# EAGLE design EASCapeRev1A (EAGLE 8.5.2)
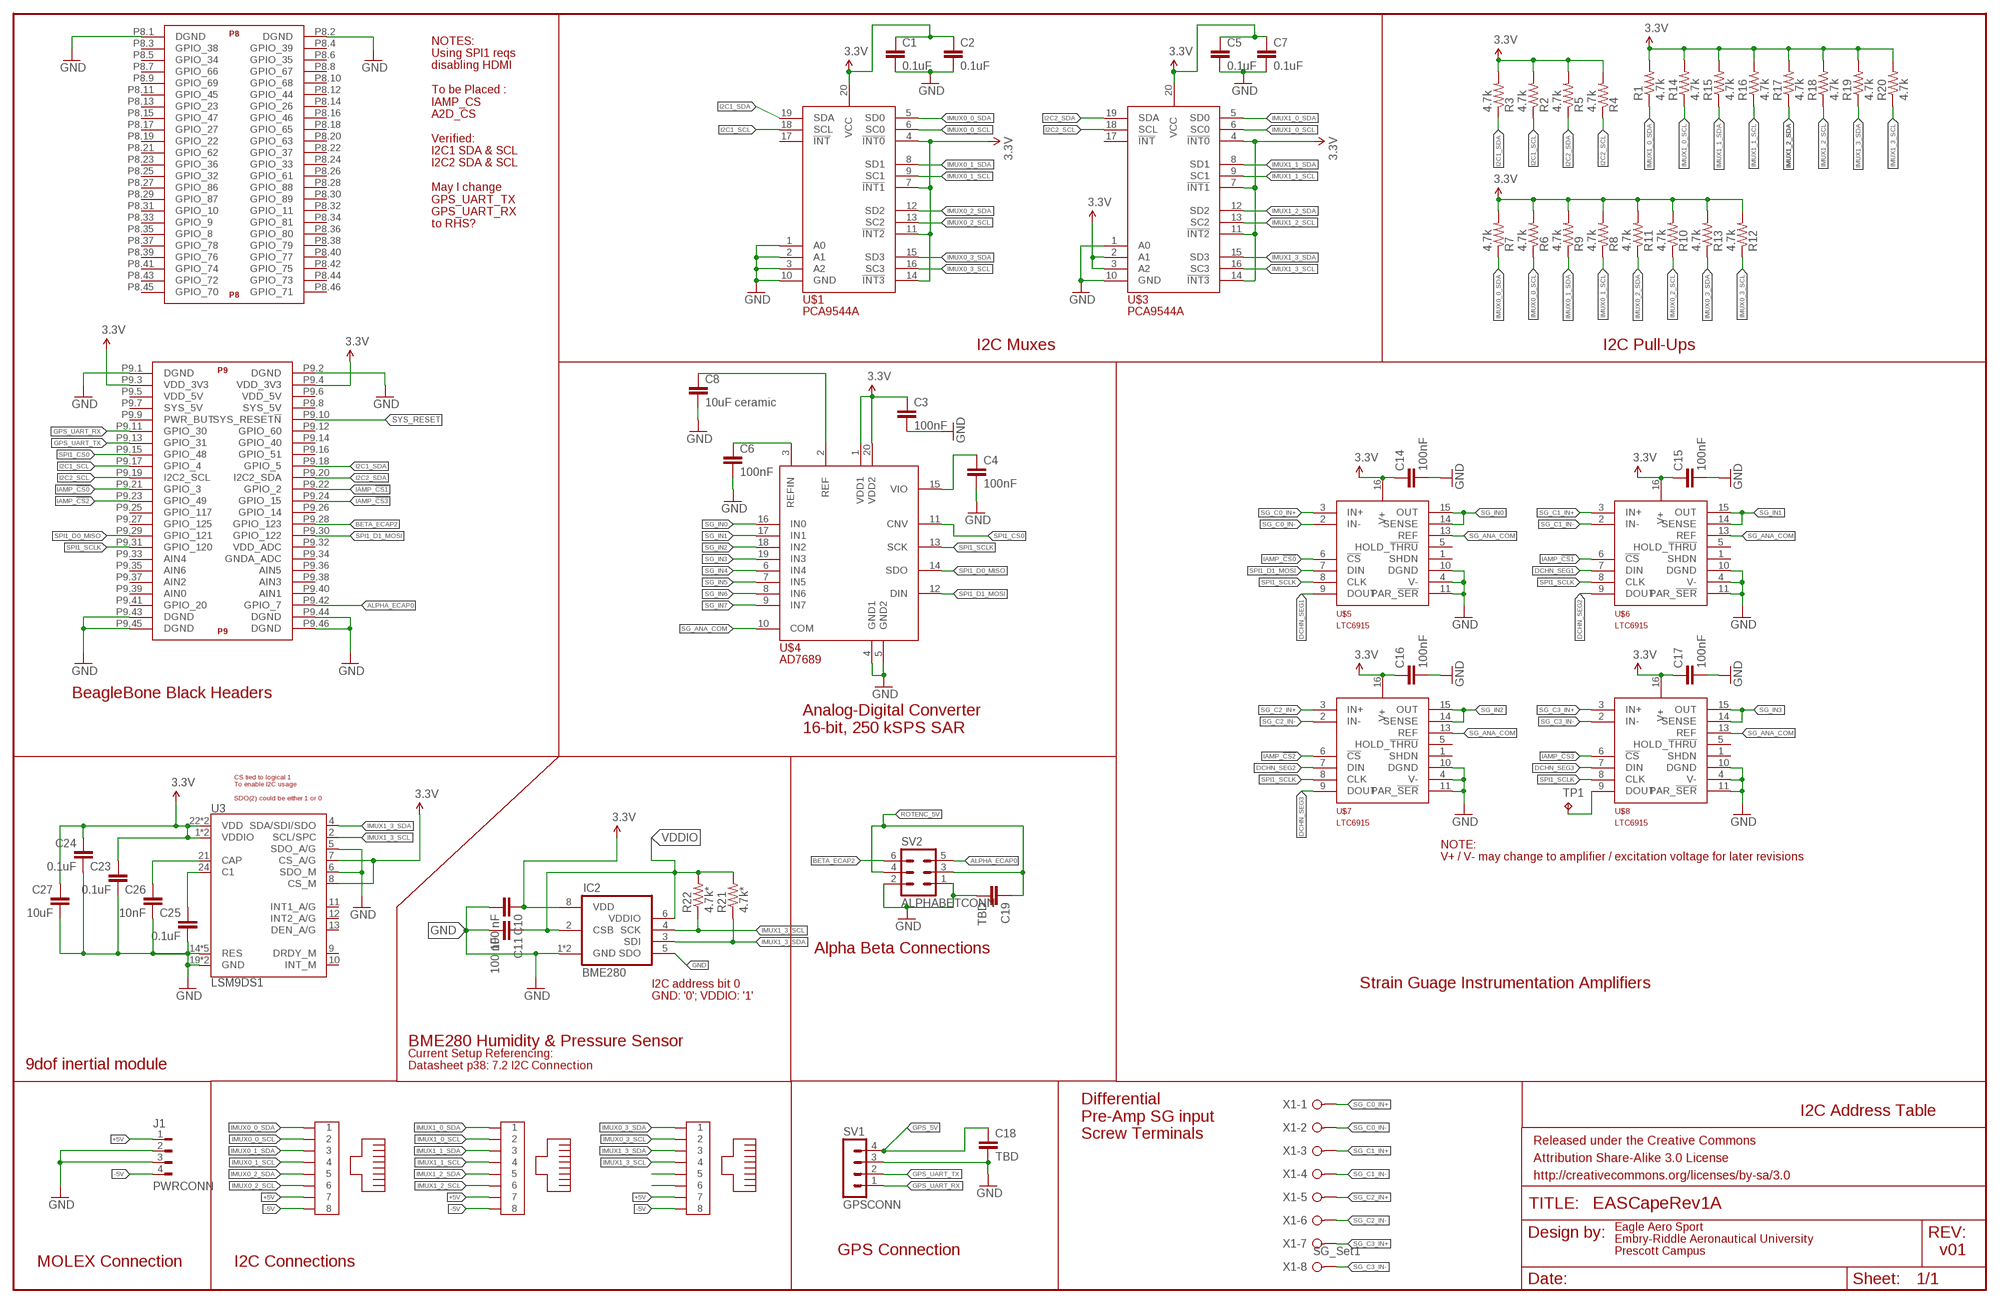
[diagram p0: schematic, sheet 1]

## Parts
C1  0.1uF  CAP0805  [0805]
C2  0.1uF  CAP0805  [0805]
C3  100nF  CAP0805  [0805]
C4  100nF  CAP0805  [0805]
C5  0.1uF  CAP0805  [0805]
C6  100nF  CAP0805  [0805]
C7  0.1uF  CAP0805  [0805]
C8  10uF ceramic  CAP0805  [0805]
C10  100 nF  CAP0805  [0805]
C11  100 nF  CAP0805  [0805]
C14  100nF  CAP0805  [0805]
C15  100nF  CAP0805  [0805]
C16  100nF  CAP0805  [0805]
C17  100nF  CAP0805  [0805]
C18  TBD  CAP0805  [0805]
C19  TBD  CAP0805  [0805]
C23  0.1uF  CAP0805  [0805]
C24  0.1uF  CAP0805  [0805]
C25  0.1uF  CAP0805  [0805]
C26  10nF  CAP0805  [0805]
C27  10uF  CAP0805  [0805]
FRAME1  FRAME-LEDGER  [CREATIVE_COMMONS]
IC2  BME280  [BME280]
J1  PWRCONN  FLOPPY-4350211  [350211]
R1  4.7k  RESISTOR0805-RES  [0805]
R2  4.7k  RESISTOR0805-RES  [0805]
R3  4.7k  RESISTOR0805-RES  [0805]
R4  4.7k  RESISTOR0805-RES  [0805]
R5  4.7k  RESISTOR0805-RES  [0805]
R6  4.7k  RESISTOR0805-RES  [0805]
R7  4.7k  RESISTOR0805-RES  [0805]
R8  4.7k  RESISTOR0805-RES  [0805]
R9  4.7k  RESISTOR0805-RES  [0805]
R10  4.7k  RESISTOR0805-RES  [0805]
R11  4.7k  RESISTOR0805-RES  [0805]
R12  4.7k  RESISTOR0805-RES  [0805]
R13  4.7k  RESISTOR0805-RES  [0805]
R14  4.7k  RESISTOR0805-RES  [0805]
R15  4.7k  RESISTOR0805-RES  [0805]
R16  4.7k  RESISTOR0805-RES  [0805]
R17  4.7k  RESISTOR0805-RES  [0805]
R18  4.7k  RESISTOR0805-RES  [0805]
R19  4.7k  RESISTOR0805-RES  [0805]
R20  4.7k  RESISTOR0805-RES  [0805]
R21  4.7k*  RESISTOR0805-RES  [0805]
R22  4.7k*  RESISTOR0805-RES  [0805]
RJ1  MOLEX-RJ45-SMT  [MOLEX-RJ45-SMT]
RJ2  MOLEX-RJ45-SMT  [MOLEX-RJ45-SMT]
RJ3  MOLEX-RJ45-SMT  [MOLEX-RJ45-SMT]
SV1  GPSCONN  MA04-1  [MA04-1]
SV2  ALPHABETCONN  MA03-2  [MA03-2]
TP1  TPTP08R  [TP08R]
U3  LSM9DS1  [LGA24-8X4]
U$1  PCA9544A  [TSSOP20]
U$2  BEAGLE_BONE_BLACK_CAPE  [BEAGLE_BONE_BLACK_CAPE]
U$3  PCA9544A  [TSSOP20]
U$4  AD7689  [QFN20]
U$5  LTC6915  [SSOP16]
U$6  LTC6915  [SSOP16]
U$7  LTC6915  [SSOP16]
U$8  LTC6915  [SSOP16]
X1  SG_Set1  W237-08P  [W237-8P]

## Nets
3.3V: C1.1 C2.1 C3.1 C5.1 C7.1 C10.1 C14.1 C15.1 C16.1 C17.1 C23.1 C24.1 C27.1 IC2.8(VDD) R1.2 R2.2 R3.2 R4.2 R5.2 R6.2 R7.2 R8.2 R9.2 R10.2 R11.2 R12.2 R13.2 R14.2 R15.2 R16.2 R17.2 R18.2 R19.2 R20.2 U3.1(VDDIO) U3.3(VDDIO) U3.7(CS_A/G) U3.8(CS_M) U3.22(VDD) U3.23(VDD) U$1.4(!INT0!) U$1.7(!INT1!) U$1.11(!INT2!) U$1.14(!INT3!) U$1.20(VCC) U$2.P9.3(P9:VDD_3V3) U$2.P9.4(P9:VDD_3V3) U$3.2(A1) U$3.3(A2) U$3.4(!INT0!) U$3.7(!INT1!) U$3.11(!INT2!) U$3.14(!INT3!) U$3.20(VCC) U$4.1(VDD1) U$4.20(VDD2) U$5.16(V+) U$6.16(V+) U$7.16(V+) U$8.16(V+)
+5V: J1.1 RJ1.7 RJ2.7 RJ3.7
-5V: J1.4 RJ1.8 RJ2.8 RJ3.8
ALPHA_ECAP0: SV2.5 U$2.P9.42(P9:GPIO_7)
BETA_ECAP2: SV2.6 U$2.P9.28(P9:GPIO_123)
C1: C25.1 U3.24(C1)
CAP: C26.1 U3.21(CAP)
DCHN_SEG1: U$5.9(DOUT) U$6.7(DIN)
DCHN_SEG2: U$6.9(DOUT) U$7.7(DIN)
DCHN_SEG3: U$7.9(DOUT) U$8.7(DIN)
GND: C1.2 C2.2 C3.2 C4.2 C5.2 C6.2 C7.2 C8.2 C10.2 C11.2 C14.2 C15.2 C16.2 C17.2 C18.2 C19.2 C23.2 C24.2 C25.2 C26.2 C27.2 IC2.1(GND) IC2.5(SDO) IC2.7(GND) J1.2 J1.3 SV1.3 SV2.1 SV2.2 U3.5(SDO_A/G) U3.6(SDO_M) U3.14(RES) U3.15(RES) U3.16(RES) U3.17(RES) U3.18(RES) U3.19(GND) U3.20(GND) U$1.1(A0) U$1.2(A1) U$1.3(A2) U$1.10(GND) U$2.P8.1(P8:DGND) U$2.P8.2(P8:DGND) U$2.P9.1(P9:DGND) U$2.P9.2(P9:DGND) U$2.P9.43(P9:DGND) U$2.P9.44(P9:DGND) U$2.P9.45(P9:DGND) U$2.P9.46(P9:DGND) U$3.1(A0) U$3.10(GND) U$4.4(GND1) U$4.5(GND2) U$5.4(V-) U$5.10(DGND) U$5.11(PAR_!SER!) U$6.4(V-) U$6.10(DGND) U$6.11(PAR_!SER!) U$7.4(V-) U$7.10(DGND) U$7.11(PAR_!SER!) U$8.4(V-) U$8.10(DGND) U$8.11(PAR_!SER!)
GPS_5V: C18.1 SV1.4
GPS_UART_RX: SV1.1 U$2.P9.11(P9:GPIO_30)
GPS_UART_TX: SV1.2 U$2.P9.13(P9:GPIO_31)
I2C1_SCL: R2.1 U$1.18(SCL) U$2.P9.17(P9:GPIO_4)
I2C1_SDA: R3.1 U$1.19(SDA) U$2.P9.18(P9:GPIO_5)
I2C2_SCL: R4.1 U$2.P9.19(P9:I2C2_SCL) U$3.18(SCL)
I2C2_SDA: R5.1 U$2.P9.20(P9:I2C2_SDA) U$3.19(SDA)
IAMP_!CS0!: U$2.P9.21(P9:GPIO_3) U$5.6(!CS!)
IAMP_!CS1!: U$2.P9.22(P9:GPIO_2) U$6.6(!CS!)
IAMP_!CS2!: U$2.P9.23(P9:GPIO_49) U$7.6(!CS!)
IAMP_!CS3!: U$2.P9.24(P9:GPIO_15) U$8.6(!CS!)
IMUX0_0_SCL: R6.1 RJ1.2 U$1.6(SC0)
IMUX0_0_SDA: R7.1 RJ1.1 U$1.5(SD0)
IMUX0_1_SCL: R8.1 RJ1.4 U$1.9(SC1)
IMUX0_1_SDA: R9.1 RJ1.3 U$1.8(SD1)
IMUX0_2_SCL: R10.1 RJ1.6 U$1.13(SC2)
IMUX0_2_SDA: R11.1 RJ1.5 U$1.12(SD2)
IMUX0_3_SCL: R12.1 RJ3.2 U$1.16(SC3)
IMUX0_3_SDA: R13.1 RJ3.1 U$1.15(SD3)
IMUX1_0_SCL: R14.1 RJ2.2 U$3.6(SC0)
IMUX1_0_SDA: R1.1 RJ2.1 U$3.5(SD0)
IMUX1_1_SCL: R16.1 RJ2.4 U$3.9(SC1)
IMUX1_1_SDA: R15.1 RJ2.3 U$3.8(SD1)
IMUX1_2_SCL: R18.1 RJ2.6 U$3.13(SC2)
IMUX1_2_SDA: R17.1 RJ2.5 U$3.12(SD2)
IMUX1_3_SCL: IC2.4(SCK) R20.1 R22.1 RJ3.4 U3.2(SCL/SPC) U$3.16(SC3)
IMUX1_3_SDA: IC2.3(SDI) R19.1 R21.1 RJ3.3 U3.4(SDA/SDI/SDO) U$3.15(SD3)
N$5: C6.1 U$4.3(REFIN)
N$6: C8.1 U$4.2(REF)
N$12: C4.1 U$4.15(VIO)
N$19: TP1.TP U$8.9(DOUT)
N$45: RJ3.6
N$47: RJ3.5
ROTENC_5V: C19.1 SV2.3 SV2.4
SG_ANA_COM: U$4.10(COM) U$5.13(REF) U$6.13(REF) U$7.13(REF) U$8.13(REF)
SG_C0_IN+: U$5.3(IN+) X1.1
SG_C0_IN-: U$5.2(IN-) X1.2
SG_C1_IN+: U$6.3(IN+) X1.3
SG_C1_IN-: U$6.2(IN-) X1.4
SG_C2_IN+: U$7.3(IN+) X1.5
SG_C2_IN-: U$7.2(IN-) X1.6
SG_C3_IN+: U$8.3(IN+) X1.7
SG_C3_IN-: U$8.2(IN-) X1.8
SG_IN0: U$4.16(IN0) U$5.14(SENSE) U$5.15(OUT)
SG_IN1: U$4.17(IN1) U$6.14(SENSE) U$6.15(OUT)
SG_IN2: U$4.18(IN2) U$7.14(SENSE) U$7.15(OUT)
SG_IN3: U$4.19(IN3) U$8.14(SENSE) U$8.15(OUT)
SG_IN4: U$4.6(IN4)
SG_IN5: U$4.7(IN5)
SG_IN6: U$4.8(IN6)
SG_IN7: U$4.9(IN7)
SPI1_CS0: U$2.P9.15(P9:GPIO_48) U$4.11(CNV)
SPI1_D0_MISO: U$2.P9.29(P9:GPIO_121) U$4.14(SDO)
SPI1_D1_MOSI: U$2.P9.30(P9:GPIO_122) U$4.12(DIN) U$5.7(DIN)
SPI1_SCLK: U$2.P9.31(P9:GPIO_120) U$4.13(SCK) U$5.8(CLK) U$6.8(CLK) U$7.8(CLK) U$8.8(CLK)
SYS_RESET: U$2.P9.10(P9:SYS_RESET!N)
VDDIO: C11.1 IC2.2(CSB) IC2.6(VDDIO) R21.2 R22.2
Unconnected: U3.9(DRDY_M) U3.10(INT_M) U3.11(INT1_A/G) U3.12(INT2_A/G) U3.13(DEN_A/G) U$1.17(!INT!) U$2.P8.3(P8:GPIO_38) U$2.P8.4(P8:GPIO_39) U$2.P8.5(P8:GPIO_34) U$2.P8.6(P8:GPIO_35) U$2.P8.7(P8:GPIO_66) U$2.P8.8(P8:GPIO_67) U$2.P8.9(P8:GPIO_69) U$2.P8.10(P8:GPIO_68) U$2.P8.11(P8:GPIO_45) U$2.P8.12(P8:GPIO_44) U$2.P8.13(P8:GPIO_23) U$2.P8.14(P8:GPIO_26) U$2.P8.15(P8:GPIO_47) U$2.P8.16(P8:GPIO_46) U$2.P8.17(P8:GPIO_27) U$2.P8.18(P8:GPIO_65) U$2.P8.19(P8:GPIO_22) U$2.P8.20(P8:GPIO_63) U$2.P8.21(P8:GPIO_62) U$2.P8.22(P8:GPIO_37) U$2.P8.23(P8:GPIO_36) U$2.P8.24(P8:GPIO_33) U$2.P8.25(P8:GPIO_32) U$2.P8.26(P8:GPIO_61) U$2.P8.27(P8:GPIO_86) U$2.P8.28(P8:GPIO_88) U$2.P8.29(P8:GPIO_87) U$2.P8.30(P8:GPIO_89) U$2.P8.31(P8:GPIO_10) U$2.P8.32(P8:GPIO_11) U$2.P8.33(P8:GPIO_9) U$2.P8.34(P8:GPIO_81) U$2.P8.35(P8:GPIO_8) U$2.P8.36(P8:GPIO_80) U$2.P8.37(P8:GPIO_78) U$2.P8.38(P8:GPIO_79) U$2.P8.39(P8:GPIO_76) U$2.P8.40(P8:GPIO_77) U$2.P8.41(P8:GPIO_74) U$2.P8.42(P8:GPIO_75) U$2.P8.43(P8:GPIO_72) U$2.P8.44(P8:GPIO_73) U$2.P8.45(P8:GPIO_70) U$2.P8.46(P8:GPIO_71) U$2.P9.5(P9:VDD_5V) U$2.P9.6(P9:VDD_5V) U$2.P9.7(P9:SYS_5V) U$2.P9.8(P9:SYS_5V) U$2.P9.9(P9:PWR_BUT) U$2.P9.12(P9:GPIO_60) U$2.P9.14(P9:GPIO_40) U$2.P9.16(P9:GPIO_51) U$2.P9.25(P9:GPIO_117) U$2.P9.26(P9:GPIO_14) U$2.P9.27(P9:GPIO_125) U$2.P9.32(P9:VDD_ADC) U$2.P9.33(P9:AIN4) U$2.P9.34(P9:GNDA_ADC) U$2.P9.35(P9:AIN6) U$2.P9.36(P9:AIN5) U$2.P9.37(P9:AIN2) U$2.P9.38(P9:AIN3) U$2.P9.39(P9:AIN0) U$2.P9.40(P9:AIN1) U$2.P9.41(P9:GPIO_20) U$3.17(!INT!) U$5.1(SHDN) U$5.5(HOLD_!THRU!) U$6.1(SHDN) U$6.5(HOLD_!THRU!) U$7.1(SHDN) U$7.5(HOLD_!THRU!) U$8.1(SHDN) U$8.5(HOLD_!THRU!)

## Notes on the sheet
- NOTES:
  Using SPI1 reqs 
  disabling HDMI
  
  To be Placed : 
  IAMP_CS
  A2D_CS
  
  Verified:
  I2C1 SDA & SCL
  I2C2 SDA & SCL
  
  May I change 
  GPS_UART_TX
  GPS_UART_RX
  to RHS?
- I2C Muxes | I2C Pull-Ups
- BeagleBone Black Headers
- Analog-Digital Converter
  16-bit, 250 kSPS SAR
- CS tied to logical 1
  To enable I2C usage
  
  SDO(2) could be either 1 or 0
- NOTE:
  V+ / V- may change to amplifier / excitation voltage for later revisions
- Alpha Beta Connections
- Strain Guage Instrumentation Amplifiers
- I2C address bit 0
  GND: '0'; VDDIO: '1'
- BME280 Humidity & Pressure Sensor
- 9dof inertial module
- Current Setup Referencing: 
  Datasheet p38: 7.2 I2C Connection
- I2C Address Table
- Differential
  Pre-Amp SG input
  Screw Terminals
- GPS Connection
- Eagle Aero Sport
  Embry-Riddle Aeronautical University
  Prescott Campus
- v01
- MOLEX Connection | I2C Connections

## Library data of the parts
C1-C8 C10 C11 C14-C19 C23-C27 = SparkFun-Capacitors:CAP: Capacitor Standard 0603 ceramic capacitor, and 0.1" leaded capacitor.
FRAME1 = SparkFun-Aesthetics:FRAME-LEDGER: Schematic Frame Standard 11x14 US Ledger frame
IC2 = bosch-bme280:BME280: DIGITAL HUMIDITY, PRESSURE AND TEMPERATURE SENSOR * Digital interface I²C (up to 3.4 MHz) and SPI (3 and 4 wire, up to 10 MHz)* Supply voltage VDD main supply voltage range: 1.71 V to 3.6 V*VDDIO interface voltage range: 1.2 V to 3.6 V Operating range -40…+85 °C, 0…100 % rel. humidity, 300…1100 hPa The library has been designed by Richard Magdycz <https://www.facebook.com/groups/eaglecadsoftUK>
J1 = con-amp:FLOPPY-4: MATE N-LOCK Floppy / HDD conector Distributor: Bürklin 71F970
R1-R22 = SparkFun-Resistors:RESISTOR: Resistor Basic schematic elements and footprints for 0603, 1206, and PTH resistors.
RJ1-RJ3 = con-molex-rj45-smt-with-mounting-wings:MOLEX-RJ45-SMT
SV1 = con-lstb:MA04-1: PIN HEADER; OC_FARNELL: unknown; OC_NEWARK: unknown
SV2 = con-lstb:MA03-2: PIN HEADER; OC_FARNELL: unknown; OC_NEWARK: unknown
TP1 = testpad:TP: Test pad
U3 = LSM9DS1_temp:LSM9DS1: LSM9DS1 3D accelerometer, gyroscope & magnetometer The LSM9DS1 is a system-in-package featuring a 3D digital linear acceleration sensor, a 3D digital angular rate sensor, and a 3D digital magnetic sensor. The LSM9DS1 has a linear acceleration full scale of ±2g/±4g/±8/±16 g, a magnetic field full scale of ±4/±8/±12/±16 gauss and an angular rate of ±245/±500/±2000 dps. The LSM9DS1 includes an I2 C serial bus interface supporting standard and fast mode (100 kHz and 400 kHz) and an SPI serial standard interface. Magnetic, accelerometer and gyroscope sensing can be enabled or set in power-down mode separately for smart power management. The LSM9DS1 is available in a plastic land grid array package (LGA) and it is guaranteed to operate over an extended temperature range from -40 °C to +85 °C.; PROD_ID: IC-12536
U$1 U$3 = EagleAeroSport:PCA9544A: PCA9544A Low Voltage 4-Channel I2C Mux
U$2 = SparkFun-Boards:BEAGLE_BONE_BLACK_CAPE
U$4 = EagleAeroSport:AD7689: AD7689 Analog Devices 16-bit, 8-channel, 250kSPS PulSAR ADC http://www.analog.com/en/products/analog-to-digital-converters/ad-converters/ad7689.html
U$5-U$8 = EagleAeroSport:LTC6915: LTC6915 Zero Drift, Precision Instrumentation Amplifier with Digitally Programmable Gain http://www.linear.com/product/LTC6915
X1 = con-wago-508:W237-08P: WAGO SREW CLAMP; OC_FARNELL: unknown; OC_NEWARK: unknown

## Board
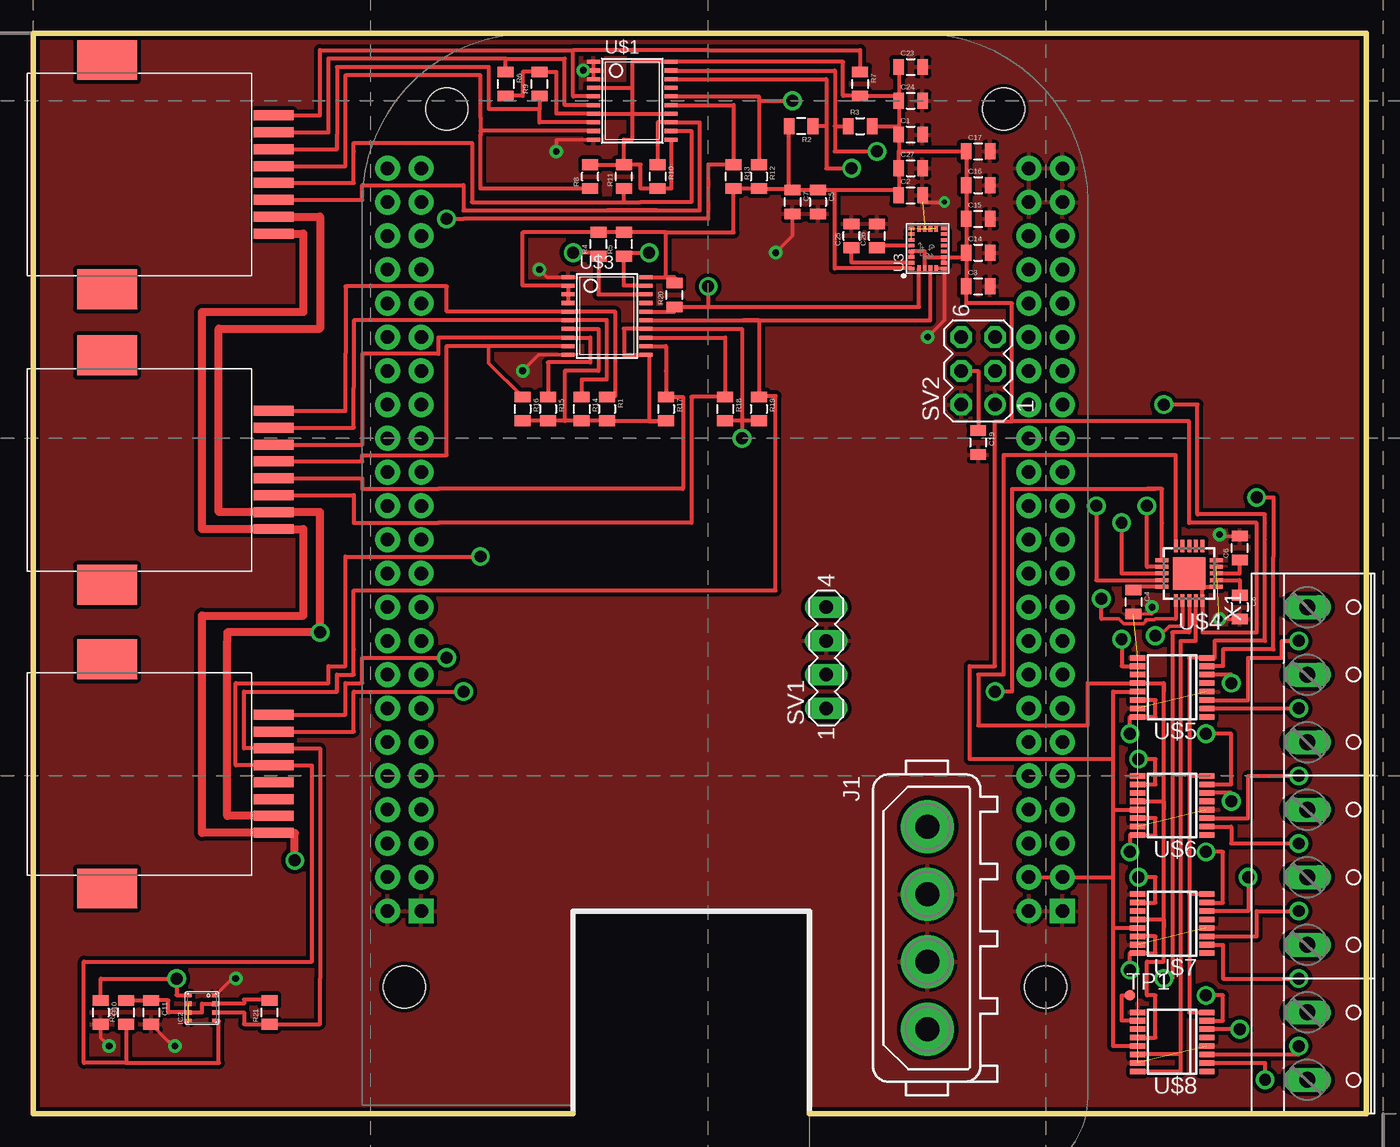
[diagram p1: board, top side]
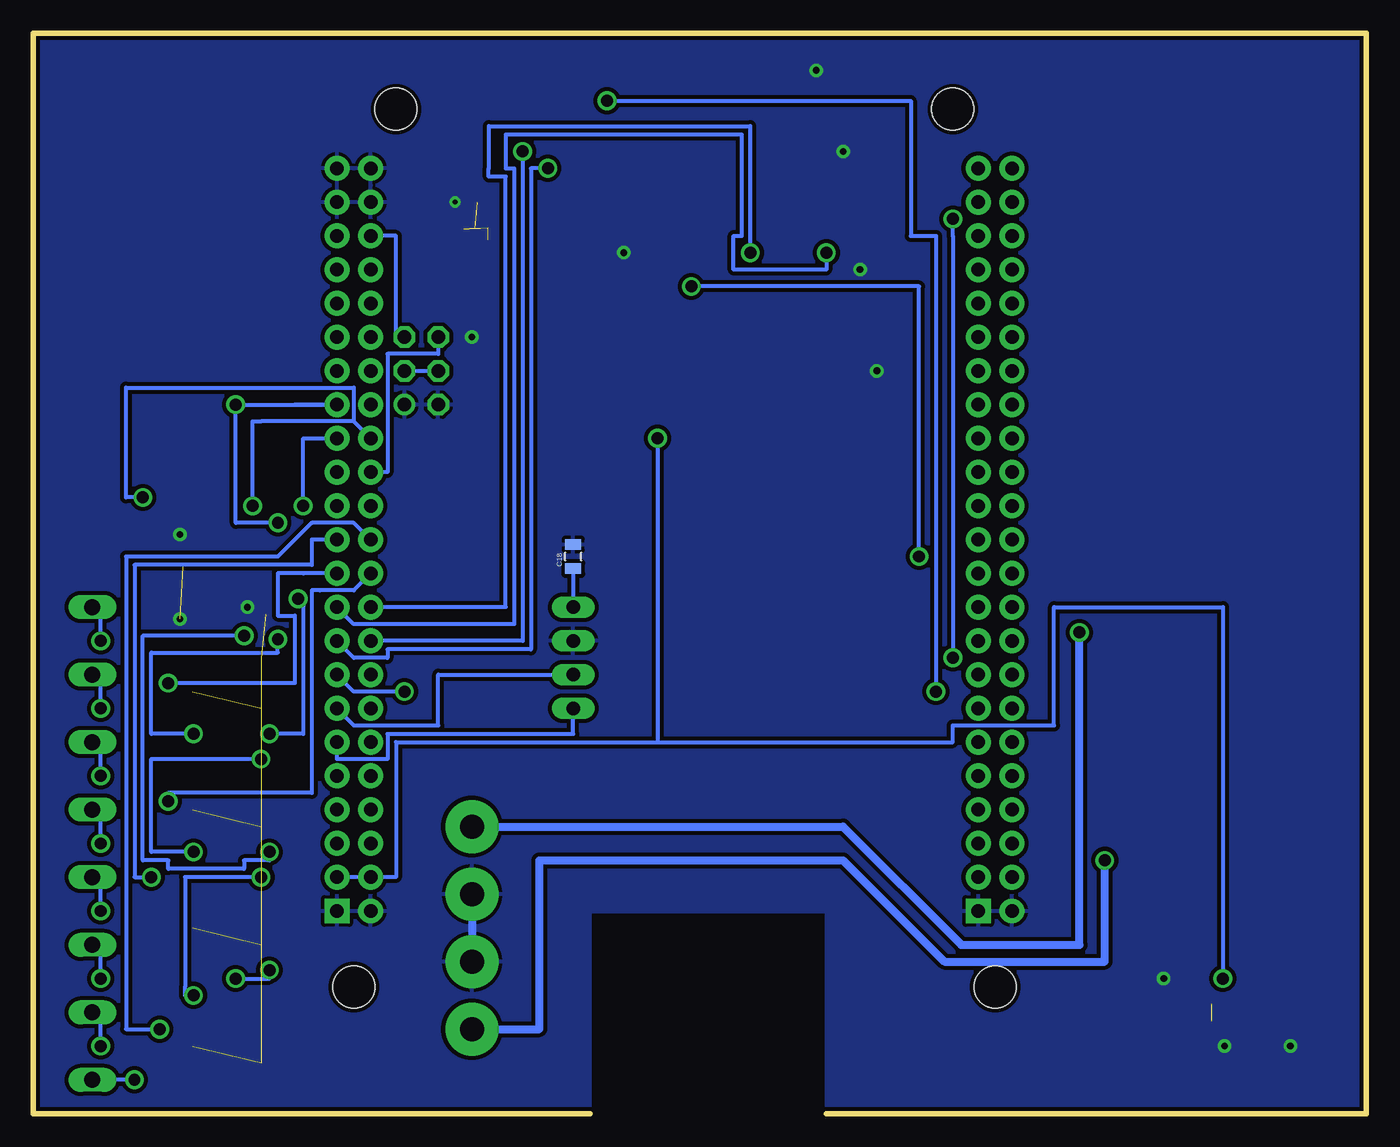
[diagram p2: board, bottom side, seen from below]

Size 100.33 x 81.28 mm. Coordinates in mm from the lower left corner, seen from the top.
Outline: 40.64,0 0,0 0,81.28 100.33,81.28 100.33,0 58.42,0
Copper layers (1*16): Top 0.035mm / dielectric 1.5mm / Bottom 0.035mm
Design rules "SparkFun-2-layer": minimum track width 7mil, minimum drill 15mil, track to track 8mil, track to pad 8mil, pad to pad 8mil, via to via 8mil, smd to smd 8mil, copper to edge 8mil, drill to drill 8mil, minimum pad ring 12mil, minimum via ring 10mil, stop-mask expansion 4mil, vias tented up to drill 20mil, thermal gap 10mil

### Footprints (pad centres in the part's own frame; a part is rotated, then mirrored left to right if it is on the bottom)
0805 = smd 0.8 x 1.2: 1 -0.9,0; 2 0.9,0
BME280 = smd 0.35 x 0.5: 1 0.975,-1.025; 2 0.325,-1.025; 3 -0.325,-1.025; 4 -0.975,-1.025; 5 -0.975,1.025; 6 -0.325,1.025; 7 0.325,1.025; 8 0.975,1.025
350211 = drill 1.8 pad 4: 1 -7.62,0; 2 -2.54,0; 3 2.54,0; 4 7.62,0
MOLEX-RJ45-SMT = smd 3 x 0.75: 1 10.48,4.61; 2 10.48,3.34; 3 10.48,2.07; 4 10.48,0.8; 5 10.48,-0.47; 6 10.48,-1.74; 7 10.48,-3.01; 8 10.48,-4.28 | smd 4.5 x 3: P$1 -2.06,-8.47; P$2 -2.06,8.78
MA04-1 = drill 1.016 long: 1 -3.81,0; 2 -1.27,0; 3 1.27,0; 4 3.81,0
MA03-2 = drill 1.016: 1 -2.54,-1.27 | drill 1.016 octagon: 2 -2.54,1.27; 3 0,-1.27; 4 0,1.27; 5 2.54,-1.27; 6 2.54,1.27
TP08R = smd 0.8 x 0.8: TP 0,0
LGA24-8X4 = smd 0.27 x 0.45: 1 -1.505,1.225; 6 -1.505,-1.225; 7 -1.075,-1.225; 8 -0.645,-1.225; 9 -0.215,-1.225; 10 0.215,-1.225; 11 0.645,-1.225; 12 1.075,-1.225; 13 1.505,-1.225; 18 1.505,1.225; 19 1.075,1.225; 20 0.645,1.225; 21 0.215,1.225; 22 -0.215,1.225; 23 -0.645,1.225; 24 -1.075,1.225 | smd 0.45 x 0.27: 2 -1.475,0.645; 3 -1.475,0.215; 4 -1.475,-0.215; 5 -1.475,-0.645; 14 1.475,-0.645; 15 1.475,-0.215; 16 1.475,0.215; 17 1.475,0.645
TSSOP20 = smd 0.305 x 0.991: 1 -2.925,-2.918; 2 -2.275,-2.918; 3 -1.625,-2.918; 4 -0.975,-2.918; 5 -0.325,-2.918; 6 0.325,-2.918; 7 0.975,-2.918; 8 1.625,-2.918; 9 2.275,-2.918; 10 2.925,-2.918; 11 2.925,2.918; 12 2.275,2.918; 13 1.625,2.918; 14 0.975,2.918; 15 0.325,2.918; 16 -0.325,2.918; 17 -0.975,2.918; 18 -1.625,2.918; 19 -2.275,2.918; 20 -2.925,2.918
BEAGLE_BONE_BLACK_CAPE = drill 1.016 pad 1.88 square: P8.1 20.32,50.165; P9.1 20.32,1.905 | drill 1.016 pad 1.88: P8.2 20.32,52.705; P8.3 22.86,50.165; P8.4 22.86,52.705; P8.5 25.4,50.165; P8.6 25.4,52.705; P8.7 27.94,50.165; P8.8 27.94,52.705; P8.9 30.48,50.165; P8.10 30.48,52.705; P8.11 33.02,50.165; P8.12 33.02,52.705; P8.13 35.56,50.165; P8.14 35.56,52.705; P8.15 38.1,50.165; P8.16 38.1,52.705; P8.17 40.64,50.165; P8.18 40.64,52.705; P8.19 43.18,50.165; P8.20 43.18,52.705; P8.21 45.72,50.165; P8.22 45.72,52.705; P8.23 48.26,50.165; P8.24 48.26,52.705; P8.25 50.8,50.165; P8.26 50.8,52.705; P8.27 53.34,50.165; P8.28 53.34,52.705; P8.29 55.88,50.165; P8.30 55.88,52.705; P8.31 58.42,50.165; P8.32 58.42,52.705; P8.33 60.96,50.165; P8.34 60.96,52.705; P8.35 63.5,50.165; P8.36 63.5,52.705; P8.37 66.04,50.165; P8.38 66.04,52.705; P8.39 68.58,50.165; P8.40 68.58,52.705; P8.41 71.12,50.165; P8.42 71.12,52.705; P8.43 73.66,50.165; P8.44 73.66,52.705; P8.45 76.2,50.165; P8.46 76.2,52.705; P9.2 20.32,4.445; P9.3 22.86,1.905; P9.4 22.86,4.445; P9.5 25.4,1.905; P9.6 25.4,4.445; P9.7 27.94,1.905; P9.8 27.94,4.445; P9.9 30.48,1.905; P9.10 30.48,4.445; P9.11 33.02,1.905; P9.12 33.02,4.445; P9.13 35.56,1.905; P9.14 35.56,4.445; P9.15 38.1,1.905; P9.16 38.1,4.445; P9.17 40.64,1.905; P9.18 40.64,4.445; P9.19 43.18,1.905; P9.20 43.18,4.445; P9.21 45.72,1.905; P9.22 45.72,4.445; P9.23 48.26,1.905; P9.24 48.26,4.445; P9.25 50.8,1.905; P9.26 50.8,4.445; P9.27 53.34,1.905; P9.28 53.34,4.445; P9.29 55.88,1.905; P9.30 55.88,4.445; P9.31 58.42,1.905; P9.32 58.42,4.445; P9.33 60.96,1.905; P9.34 60.96,4.445; P9.35 63.5,1.905; P9.36 63.5,4.445; P9.37 66.04,1.905; P9.38 66.04,4.445; P9.39 68.58,1.905; P9.40 68.58,4.445; P9.41 71.12,1.905; P9.42 71.12,4.445; P9.43 73.66,1.905; P9.44 73.66,4.445; P9.45 76.2,1.905; P9.46 76.2,4.445 | hole 3.175: 14.605,3.175; 80.645,6.35; 80.645,48.26; 14.605,51.435
QFN20 = smd 0.95 x 0.3: 1 -2.05,1; 2 -2.05,0.5; 3 -2.05,0; 4 -2.05,-0.5; 5 -2.05,-1; 11 2.05,-1; 12 2.05,-0.5; 13 2.05,0; 14 2.05,0.5; 15 2.05,1 | smd 0.3 x 0.95: 6 -1,-2.05; 7 -0.5,-2.05; 8 0,-2.05; 9 0.5,-2.05; 10 1,-2.05; 16 1,2.05; 17 0.5,2.05; 18 0,2.05; 19 -0.5,2.05; 20 -1,2.05 | smd 2.45 x 2.45: EXP 0,0
SSOP16 = smd 0.419 x 1.143: 1 -2.223,-2.6; 2 -1.587,-2.6; 3 -0.953,-2.6; 4 -0.318,-2.6; 5 0.318,-2.6; 6 0.953,-2.6; 7 1.587,-2.6; 8 2.223,-2.6; 9 1.587,2.6; 10 -1.587,2.6; 11 2.223,2.6; 12 0.953,2.6; 13 0.318,2.6; 14 -2.223,2.6; 15 -0.953,2.6; 16 -0.318,2.6
W237-8P = drill 1.194 long: 1 -17.78,-0.635; 2 -12.7,-0.635; 3 -7.62,-0.635; 4 -2.54,-0.635; 5 2.54,-0.635; 6 7.62,-0.635; 7 12.7,-0.635; 8 17.78,-0.635

### Placement (x,y rotation side)
C1  66.04,73.66 0 top
C2  66.04,69.09 0 top
C3  71.12,62.23 0 top
C4  82.8,38.48 270 top
C5  59.05,68.58 270 top
C6  90.81,42.55 90 top
C7  57.15,68.58 270 top
C8  90.81,38.1 270 top
C10  5.08,7.62 270 top
C11  8.89,7.62 270 top
C14  71.12,64.77 0 top
C15  71.12,67.31 0 top
C16  71.12,69.85 0 top
C17  71.12,72.39 0 top
C18  59.69,41.91 90 bottom
C19  71.12,50.48 270 top
C23  66.04,78.74 0 top
C24  66.04,76.2 0 top
C25  61.59,66.04 90 top
C26  63.5,66.04 90 top
C27  66.04,71.12 0 top
FRAME1  132.08,59.69 270 top  (outside the outline)
IC2  12.7,7.94 90 top
J1  67.31,13.97 270 top
R1  43.18,53.02 270 top
R2  57.78,74.3 180 top
R3  62.23,74.3 0 top
R4  42.55,65.41 90 top
R5  44.45,65.41 90 top
R6  35.56,77.47 270 top
R7  62.23,77.47 270 top
R8  41.91,70.48 90 top
R9  38.1,77.47 90 top
R10  46.99,70.48 270 top
R11  44.45,70.48 90 top
R12  54.61,70.48 270 top
R13  52.7,70.48 270 top
R14  41.27,53.02 270 top
R15  38.73,53.02 270 top
R16  36.83,53.02 270 top
R17  47.62,53.02 270 top
R18  52.07,53.02 270 top
R19  54.61,53.02 270 top
R20  48.26,61.59 90 top
R21  17.78,7.62 90 top
R22  6.99,7.62 90 top
RJ1  7.62,70.48 0 top
RJ2  7.62,48.26 0 top
RJ3  7.62,25.4 0 top
SV1  59.69,34.29 90 top
SV2  71.12,55.88 90 top
TP1  82.55,8.89 0 top
U3  67.31,65.09 90 top
U$1  45.09,76.2 270 top
U$2  79.38,-5.08 90 top
U$3  43.18,60.01 270 top
U$4  87,40.64 180 top
U$5  85.72,32.07 90 top
U$6  85.72,23.18 90 top
U$7  85.72,14.29 90 top
U$8  85.72,5.4 90 top
X1  96.52,20.32 270 top

### Tracks (layer width: path | path; a pad name or v marks a point on that pad's centre or on a via)
3.3V  (via drill 0.9 pad 1.02)
  Top 0.305: 65.14,72.39 C17.1 C16.1 C15.1 C14.1 | C14.1 C3.1 | 70.17,61.91 C3.1 | U$8.16 81.28,5.08 81.28,13.97 | 81.28,13.97 U$7.16 | 81.28,13.97 81.28,17.78 | 81.28,17.78 81.28,22.86 | 81.28,22.86 U$6.16 | 81.28,22.86 81.28,26.67 | 81.28,26.67 81.28,31.75 U$5.16 | C10.1 5.08,10.16 v10.79,10.16 10.79,8.91 IC2.8 | 65.14,72.39 C27.1 C2.1 65.14,69.48 60.33,69.48 | C23.1 C24.1 | C24.1 65.14,74.3 | 65.14,74.3 C1.1 65.14,72.39 | R6.2 36.83,76.57 36.83,78.37 R9.2 39.37,78.37 39.37,75.22 U$1.7 45.09,75.22 | 45.09,75.22 U$1.14 | U$1.4 45.09,77.17 | 45.09,77.17 45.09,75.22 | 45.09,77.17 45.09,79.12 U$1.20 60.96,79.12 60.96,76.57 R7.2 65.14,76.57 C24.1 | R13.2 R12.2 57.15,69.58 C7.1 | 48.26,73.28 U$1.11 48,69.58 R10.2 45.72,69.58 45.72,71.39 R11.2 | 45.09,75.22 45.09,73.28 44.45,73.28 R11.2 | R8.2 R11.2 | U3.8 70.22,64.44 C14.1 | U3.7 U3.8 | U3.23 U3.22 67.09,64.87 U3.3 67.09,64.44 U3.8 | U$2.P9.4 81.28,17.78 | R3.2 65.14,74.3 | C7.1 C5.1 60.33,69.48 | 40.01,52.12 R14.2 R1.2 R17.2 47.62,52.07 46.35,52.07 46.35,57.08 U$3.11 44.45,57.08 44.45,59.05 46.1,59.05 U$3.14 53.34,59.03 53.34,52.12 | 40.01,52.12 R15.2 R16.2 | C7.1 56.88,69.48 R2.2 | R13.2 52.97,69.58 | R19.2 53.34,52.12 | 53.34,52.12 R18.2 | 47.62,66.31 R5.2 R4.2 36.83,66.31 36.83,62.28 U$3.2 U$3.3 U$3.4 | U$3.20 47.62,62.93 | R20.2 48.26,62.93 47.62,62.93 | 47.62,62.93 47.62,66.31 | U$3.7 42.55,59.03 42.55,55.88 40.01,55.88 40.01,52.12 | 53.34,52.12 v53.34,50.8 | 47.62,66.31 52.7,66.31 R13.2 | U$4.1 88,39.64 U$4.20 88,36.2 92.08,36.2 92.08,44.45 87,44.45 87,52.07 73.66,52.07 | 73.66,52.07 73.66,60.96 70.22,60.96 C3.1 | 81.28,26.67 70.48,26.67 70.48,33.66 72.39,33.66 72.39,52.07 73.66,52.07
  Top 0.305: U3.1 60.33,63.58 60.33,69.48
  Bottom 0.305: U$2.P9.3 U$2.P9.4 73.03,17.78 73.03,27.94 53.34,27.94 | v53.34,50.8 53.34,27.94 | 53.34,27.94 31.11,27.94 31.11,29.21 23.5,29.21 23.5,38.1 10.79,38.1 v10.79,10.16
+5V  (via drill 0.9 pad 1.02)
  Top 0.61: RJ1.7 21.59,67.47 21.59,59.05 13.97,59.05 13.97,45.25 RJ2.7 21.59,45.25 v21.59,36.2 14.61,36.2 14.61,35.56 14.61,22.39 RJ3.7
  Bottom 0.61: J1.1 39.37,21.59 30.48,12.7 21.59,12.7 v21.59,36.2
-5V  (via drill 0.9 pad 1.02)
  Top 0.305: 12.7,44.13 12.7,44.45
  Top 0.406: 19.68,21.12 RJ3.8
  Top 0.61: RJ1.8 20.32,66.2 20.32,60.33 12.7,60.33 12.7,44.45 12.7,43.98 RJ2.8 20.32,43.98 20.32,41.91 20.32,37.47 12.7,37.47 12.7,21.59 12.7,21.12 RJ3.8 | v19.68,19.05 19.68,21.12
  Bottom 0.61: J1.4 62.23,6.35 62.23,19.05 39.37,19.05 31.75,11.43 19.68,11.43 v19.68,19.05
ALPHA_ECAP0
  Bottom 0.305: SV2.5 73.03,58.42 73.03,66.04 U$2.P9.42
BETA_ECAP2
  Bottom 0.305: SV2.6 69.85,57.15 73.66,57.15 73.66,48.26 U$2.P9.28
C1
  Top 0.305: U3.24 61.59,64.01 C25.1
CAP
  Top 0.305: U3.21 63.5,65.3 C26.1
DCHN_SEG1  (via drill 0.9 pad 1.02)
  Top 0.305: U$6.7 90.17,24.77 90.17,28.57 v88.27,28.57 | v81.92,35.69 81.92,33.66 U$5.9
  Bottom 0.305: v88.27,28.57 91.44,28.57 91.44,34.67 81.92,34.67 v81.92,35.69
DCHN_SEG2  (via drill 0.9 pad 1.02)
  Top 0.305: U$6.9 84.45,24.77 84.45,26.67 v83.19,26.67 | U$7.7 89.53,15.88 89.53,19.68 v88.27,19.68
  Bottom 0.305: v83.19,26.67 91.44,26.67 91.44,19.68 v88.27,19.68
DCHN_SEG3  (via drill 0.9 pad 1.02)
  Top 0.305: U$7.9 84.45,15.88 84.45,17.78 v83.19,17.78 | U$8.7 89.53,6.99 89.53,8.89 v88.27,8.89
  Bottom 0.305: v83.19,17.78 88.9,17.78 88.9,9.53 88.9,8.89 v88.27,8.89
GND  (via drill 0.35, 0.51)  (21 unrouted)
  Top 0.254: U$3.1 38.67,62.93 v38.1,63.5 | U$3.10 38.03,57.08 v36.83,55.88 | C7.2 57.15,66.04 v55.88,64.77 | IC2.1 14.97,10.16 v15.24,10.16 | C11.2 10.53,5.08 v10.67,5.08 | C10.2 5.08,5.71 v5.71,5.08 | U$1.1 U$1.2 | U$1.2 U$1.3 | U$1.2 v41.4,78.49 | U$1.10 39.37,73.28 v39.37,72.39 | U3.5 68.53,63.61 U3.6 68.58,63.58 68.58,59.69 v67.31,58.42 | C8.2 89.29,37.2 v89.28,37.21 | C6.2 89.4,43.45 v89.28,43.56 | C4.2 84.19,37.6 v84.2,38.1
  Top 0.305: C2.2 66.94,68.58 v68.58,68.58
  Bottom 0.61: J1.2 J1.3
  pour Top (isolate 0.305, rank 6): 0,81.28 100.33,81.28 100.33,0 58.42,0 58.42,15.24 40.64,15.24 40.64,0 0,0
  pour Bottom (isolate 0.305): 0,81.28 100.33,81.28 100.33,0 58.42,0 58.42,15.24 40.64,15.24 40.64,0 0,0
GPS_5V
  Bottom 0.305: C18.1 SV1.4
GPS_UART_RX
  Bottom 0.305: U$2.P9.11 77.47,26.67 73.66,26.67 73.66,28.57 59.69,28.57 SV1.1
GPS_UART_TX
  Bottom 0.305: U$2.P9.13 76.2,29.21 69.85,29.21 69.85,33.02 SV1.2
I2C1_SCL  (via drill 0.9 pad 1.02)
  Top 0.305: U$1.18 59.69,77.83 59.69,74.3 | 59.69,74.3 R2.1 | 59.69,74.3 59.69,71.12 v61.59,71.12
  Bottom 0.305: v61.59,71.12 62.87,71.12 62.87,34.92 73.66,34.92 73.66,34.29 76.2,34.29 U$2.P9.17
I2C1_SDA  (via drill 0.9 pad 1.02)
  Top 0.305: U$1.19 60.33,78.47 60.33,74.3 | 60.33,74.3 R3.1 | 60.33,74.3 60.33,72.39 v63.5,72.39
  Bottom 0.305: v63.5,72.39 63.5,35.56 U$2.P9.18
I2C2_SCL  (via drill 0.9 pad 1.02)
  Top 0.305: U$3.18 42.55,61.63 R4.1 42.55,64.77 v40.64,64.77
  Bottom 0.305: v40.64,64.77 40.64,63.5 47.62,63.5 47.62,66.04 46.99,66.04 46.99,73.66 64.77,73.66 64.77,71.12 64.14,71.12 64.14,36.83 76.2,36.83 U$2.P9.19
I2C2_SDA  (via drill 0.9 pad 1.02)
  Top 0.305: U$3.19 44.45,62.28 44.45,64.45 | 44.45,64.45 R5.1 | 44.45,64.45 44.45,64.77 v46.35,64.77
  Bottom 0.305: v46.35,64.77 46.35,74.3 66.04,74.3 66.04,71.12 66.04,70.48 64.77,70.48 64.77,38.1 U$2.P9.20
IAMP_!CS0!  (via drill 0.9 pad 1.02)
  Top 0.305: v90.17,32.38 90.17,33.02 U$5.6
  Bottom 0.305: U$2.P9.21 80.01,40.64 81.92,40.64 81.92,37.47 80.64,37.47 80.64,32.38 81.92,32.38 v90.17,32.38
IAMP_!CS1!  (via drill 0.9 pad 1.02)
  Top 0.305: U$6.6 90.17,24.13 v90.17,23.5
  Bottom 0.305: U$2.P9.22 76.2,39.37 78.74,39.37 79.38,39.37 79.38,24.13 90.17,24.13 v90.17,23.5
IAMP_!CS2!  (via drill 0.9 pad 1.02)
  Top 0.305: U$7.6 91.44,15.24 v91.44,17.78
  Bottom 0.305: U$2.P9.23 79.38,43.18 79.38,41.27 92.71,41.27 92.71,17.78 v91.44,17.78
IAMP_!CS3!  (via drill 0.9 pad 1.02)
  Top 0.305: v90.81,6.35 U$8.6
  Bottom 0.305: U$2.P9.24 76.2,44.45 79.38,44.45 81.92,41.91 93.34,41.91 93.34,6.35 v90.81,6.35
IMUX0_0_SCL
  Top 0.305: RJ1.2 22.23,73.83 22.23,79.38 35.56,79.38 | R6.1 35.56,79.38 | 35.56,79.38 40.01,79.38 40.01,75.88 U$1.6
IMUX0_0_SDA
  Top 0.305: RJ1.1 21.59,75.09 21.59,80.01 40.64,80.01 | 40.64,80.01 50.8,80.01 62.23,80.01 R7.1 | U$1.5 40.64,76.53 40.64,80.01
IMUX0_1_SCL
  Top 0.305: RJ1.4 23.5,71.28 23.5,78.11 33.66,78.11 33.66,74.93 33.66,73.61 | R8.1 33.66,69.58 33.66,73.61 | U$1.9 33.66,73.92 33.66,73.61
IMUX0_1_SDA
  Top 0.305: RJ1.3 22.86,72.56 22.86,73.66 22.86,78.74 34.29,78.74 34.29,75.56 38.1,75.56 | R9.1 38.1,75.56 | U$1.8 38.1,74.58 38.1,75.56
IMUX0_2_SCL
  Top 0.305: RJ1.6 24.77,68.75 24.77,69.85 32.38,69.85 32.38,67.94 46.99,67.94 | 46.99,67.94 43.18,67.94 46.99,67.94 | 46.99,67.94 50.16,67.94 50.16,74.58 U$1.13 46.99,74.58 R10.1
IMUX0_2_SDA
  Top 0.305: RJ1.5 24.13,70.02 24.13,72.39 24.13,73.03 33.02,73.03 33.02,68.58 44.45,68.58 | 44.45,68.58 R11.1 | 44.45,68.58 45.72,68.58 49.53,68.58 49.53,73.92 U$1.12
IMUX0_3_SCL  (via drill 0.9 pad 1.02)
  Top 0.305: RJ3.2 24.13,28.74 24.13,31.75 v32.38,31.75 | U$1.16 54.61,76.53 54.61,76.2 | 54.61,76.2 R12.1 | 54.61,76.2 v57.15,76.2
  Bottom 0.305: v57.15,76.2 34.29,76.2 34.29,66.04 32.38,66.04 v32.38,31.75
IMUX0_3_SDA  (via drill 0.9 pad 1.02)
  Top 0.305: RJ3.1 23.5,30.01 23.5,32.38 24.77,32.38 24.77,34.29 v31.11,34.29 | U$1.15 50.8,75.88 52.7,75.88 R13.1 50.8,71.39 50.8,67.31 32.38,67.31 v31.11,67.31
  Bottom 0.305: v31.11,34.29 31.11,66.04 v31.11,67.31
IMUX1_0_SCL
  Top 0.305: RJ2.2 24.13,51.6 24.13,54.61 24.13,59.68 U$3.6 43.18,59.69 43.18,55.24 41.27,55.24 R14.1
IMUX1_0_SDA
  Top 0.305: RJ2.1 23.5,52.87 23.5,57.15 23.5,62.23 31.11,62.23 31.11,60.33 U$3.5 43.81,60.33 43.81,53.98 R1.1
IMUX1_1_SCL
  Top 0.254: 34.29,57.73 34.29,56.46 R16.1
  Top 0.305: RJ2.4 24.77,49.06 24.77,49.53 31.11,49.53 31.11,57.73 34.29,57.73 U$3.9
IMUX1_1_SDA
  Top 0.305: RJ2.3 24.77,50.33 24.77,57.15 30.48,57.15 30.48,58.38 U$3.8 41.91,58.38 41.91,56.52 38.73,56.52 R15.1
IMUX1_2_SCL
  Top 0.305: RJ2.6 24.13,46.52 | 24.13,46.52 24.13,44.45 | 24.13,46.52 24.13,44.45 | 24.13,44.45 30.48,44.45 49.53,44.45 49.53,53.92 R18.1 52.07,58.38 U$3.13
IMUX1_2_SDA
  Top 0.305: RJ2.5 24.77,47.79 24.77,46.99 30.48,46.99 48.9,46.99 48.9,53.92 R17.1 47.62,53.98 47.62,55.88 47.62,57.73 U$3.12
IMUX1_3_SCL  (via drill 0.9 pad 1.02)
  Top 0.305: 13.72,6.99 IC2.4 13.97,6.96 13.97,3.81 6.99,3.81 | R22.1 6.99,3.81 | 6.99,3.81 3.81,3.81 3.81,11.43 20.95,11.43 20.95,26.2 RJ3.4 15.24,26.2 15.24,32.38 22.23,32.38 22.23,33.66 23.5,33.66 23.5,41.91 v33.66,41.91 | 50.8,60.7 R20.1 48.26,60.33 U$3.16 | 50.8,60.7 66.67,60.7 U3.2 | v50.8,62.23 50.8,60.7
  Bottom 0.305: v33.66,41.91 33.66,62.23 v50.8,62.23
IMUX1_3_SDA
  Top 0.305: IC2.3 15.88,7.62 15.88,6.72 R21.1 21.59,6.72 21.59,10.16 21.59,27.47 RJ3.3 15.88,27.47 15.88,31.75 22.86,31.75 22.86,33.02 24.13,33.02 24.13,34.92 24.13,39.37 55.88,39.37 55.88,53.98 54.61,53.98 | U$3.15 54.61,59.68 | 54.61,59.68 54.61,53.98 | 54.61,53.98 R19.1 54.61,53.98 | 54.61,59.68 53.39,59.68 | 53.39,59.68 54.61,59.68 | 54.61,59.68 55.88,59.68 | 55.88,59.68 67.53,59.68 U3.4 | 53.39,59.68 54.61,59.68 | 54.61,59.68 55.88,59.68
N$5
  Top 0.305: U$4.3 90.81,40.64 C6.1
N$6
  Top 0.305: U$4.2 90.81,40.14 C8.1
N$12
  Top 0.305: U$4.15 82.81,39.64 C4.1
N$19
  Top 0.305: U$8.9 81.92,6.99 81.92,8.89 TP1.TP
ROTENC_5V
  Top 0.305: SV2.4 71.12,55.88 C19.1
  Bottom 0.305: SV2.3 SV2.4
SG_ANA_COM
  Top 0.305: U$8.13 84.45,5.71 84.45,8.89 83.82,8.89 83.82,11.43 85.09,11.43 85.09,13.97 | 85.09,13.97 85.09,14.61 | 85.09,14.61 85.09,22.86 | 85.09,22.86 85.09,23.5 | 85.09,23.5 85.09,31.75 | 85.09,31.75 85.09,32.38 | 85.09,32.38 U$5.13 79.38,32.38 79.38,29.21 71.12,29.21 71.12,33.02 73.03,33.02 73.03,49.53 86,49.53 U$4.10 | 85.09,32.38 85.09,31.75 | U$6.13 85.09,23.5 | 85.09,23.5 85.09,22.86 | U$7.13 85.09,14.61 | 85.09,14.61 85.09,13.97
SG_C0_IN+  (via drill 0.9 pad 1.02)
  Top 0.305: U$5.3 91.44,31.11 91.44,34.29 93.98,34.29 93.98,35.56 v95.25,35.56
  Bottom 0.305: v95.25,35.56 95.25,38.1 X1.1
SG_C0_IN-  (via drill 0.9 pad 1.02)
  Top 0.305: U$5.2 v95.25,30.48
  Bottom 0.305: v95.25,30.48 95.25,33.02 X1.2
SG_C1_IN+  (via drill 0.9 pad 1.02)
  Top 0.305: U$6.3 91.44,22.23 91.44,25.4 v95.25,25.4
  Bottom 0.305: v95.25,25.4 95.25,27.94 X1.3
SG_C1_IN-  (via drill 0.9 pad 1.02)
  Top 0.305: U$6.2 90.17,21.59 90.17,20.32 v95.25,20.32
  Bottom 0.305: v95.25,20.32 95.25,22.86 X1.4
SG_C2_IN+  (via drill 0.9 pad 1.02)
  Top 0.305: U$7.3 92.08,13.34 92.08,15.24 v95.25,15.24
  Bottom 0.305: v95.25,15.24 95.25,17.78 X1.5
SG_C2_IN-  (via drill 0.9 pad 1.02)
  Top 0.305: U$7.2 89.53,12.7 89.53,10.16 v95.25,10.16
  Bottom 0.305: v95.25,10.16 95.25,12.7 X1.6
SG_C3_IN+  (via drill 0.9 pad 1.02)
  Top 0.305: U$8.3 95.25,4.45 v95.25,5.08
  Bottom 0.305: v95.25,5.08 95.25,7.62 X1.7
SG_C3_IN-  (via drill 0.9 pad 1.02)
  Top 0.305: U$8.2 92.71,3.81 v92.71,2.54
  Bottom 0.305: v92.71,2.54 X1.8
SG_IN0  (via drill 0.9 pad 1.02)
  Top 0.254: 86,37.21 84.45,37.21 84.39,37.15 84.38,37.15 84.37,37.14 84.19,37.15 83.73,37.14 83.73,37.04 83.54,36.85 82.07,36.85 81.71,37.21 80.39,37.21
  Top 0.305: U$5.15 84.45,31.11 84.45,29.84 U$5.14 82.55,29.84 v82.55,28.57 | U$4.16 86,37.21 | 80.39,37.21 v80.39,38.73
  Bottom 0.305: v82.55,28.57 80.01,28.57 80.01,38.73 v80.39,38.73
SG_IN1  (via drill 0.9 pad 1.02)
  Top 0.254: 86.5,36.83 86.34,36.68 85.53,36.68 84.79,35.94 v84.45,35.94
  Top 0.305: U$6.15 84.45,22.23 84.45,20.95 U$6.14 82.55,20.95 v82.55,19.68 | U$4.17 86.5,36.83 86.5,36.7
  Bottom 0.305: v82.55,19.68 82.55,19.05 84.45,19.05 84.45,18.41 90.17,18.41 90.17,19.05 92.08,19.05 92.08,35.94 v84.45,35.94
SG_IN2  (via drill 0.9 pad 1.02)
  Top 0.305: U$7.14 83.82,12.06 | 83.82,12.06 84.45,12.06 84.45,13.34 U$7.15 | U$4.18 87,36.2 85.72,36.2 85.72,10.16 v85.09,10.16 | v82.55,10.79 82.55,12.06 83.82,12.06
  Bottom 0.305: v85.09,10.16 82.55,10.16 v82.55,10.79
SG_IN3
  Top 0.305: U$8.14 86.36,3.17 86.36,4.45 | 86.36,4.45 U$8.15 | 86.36,4.45 86.36,35.56 87.5,35.56 U$4.19
SPI1_CS0  (via drill 0.9 pad 1.02)
  Top 0.305: U$4.11 84.94,44.45 84.94,46.99 83.82,46.99 | v72.39,31.75 73.66,31.75 73.66,46.99 83.82,46.99 | 83.82,46.99 84.45,46.99
  Bottom 0.305: v72.39,31.75 76.2,31.75 U$2.P9.15
SPI1_D0_MISO  (via drill 0.9 pad 1.02)
  Top 0.305: v80.01,45.72 80.01,40.14 U$4.14
  Bottom 0.305: v80.01,45.72 80.01,50.8 U$2.P9.29
SPI1_D1_MOSI  (via drill 0.9 pad 1.02)
  Top 0.305: U$4.12 83.82,41.14 v83.82,45.72 | U$5.7 89.53,33.66 89.53,34.92 93.34,34.92 93.34,41.91 93.34,46.35 v92.08,46.35
  Bottom 0.305: U$2.P9.30 76.2,52.07 | 76.2,52.07 83.19,52.07 83.82,52.07 v83.82,45.72 | 76.2,52.07 76.2,54.61 93.34,54.61 93.34,46.35 v92.08,46.35
SPI1_SCLK  (via drill 0.9 pad 1.02)
  Top 0.305: U$4.13 81.92,40.64 v81.92,44.45 | 87,25.43 87,34.29 U$5.8 88.9,34.29 88.9,35.56 92.71,35.56 92.71,43.18 92.71,44.45 92.71,45.09 87.63,45.09 87.63,53.34 v85.09,53.34 | 87,25.43 87,16.54 | 87,16.54 87,7.62 U$8.8 | 87,16.54 88.33,16.54 U$7.8 | 87,25.43 88.33,25.43 U$6.8
  Bottom 0.305: v81.92,44.45 85.09,44.45 v85.09,53.34 | v85.09,53.34 80.64,53.34 U$2.P9.31 v85.09,53.34
VDDIO
  Top 0.305: IC2.6 | IC2.6 12.7,7.62 12.7,8.26 IC2.2 15.88,8.26 15.88,8.57 17.78,8.57 R21.2 | IC2.6 10.16,7.62 10.16,8.52 C11.1 R22.2

### Text on the board
tDocu: 1 | 2 | 3 | 4 | 5 | A | 3.2" | Eagle Aero Sport | B | C | EAS BeagleBlack Cape | D | 0 | 4" | E